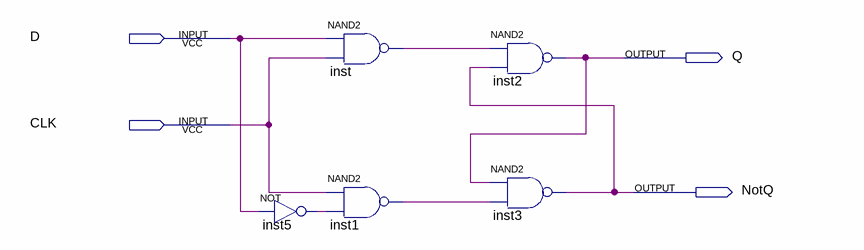
[diagram p0: schematic sheet]
// Quartus schematic D-LATCH.bdf as structural Verilog: 5 symbols, 4 pins
module \D-LATCH  (
  input  D,
  input  CLK,
  output Q,
  output NotQ
);

  wire inst1_out, inst5_out, inst_out;

  not inst5 (inst5_out, D);
  nand inst (inst_out, D, CLK);
  nand inst1 (inst1_out, CLK, inst5_out);
  nand inst2 (Q, inst_out, NotQ);
  nand inst3 (NotQ, Q, inst1_out);
endmodule
